# EAGLE design cam_new (EAGLE 9.6.2)
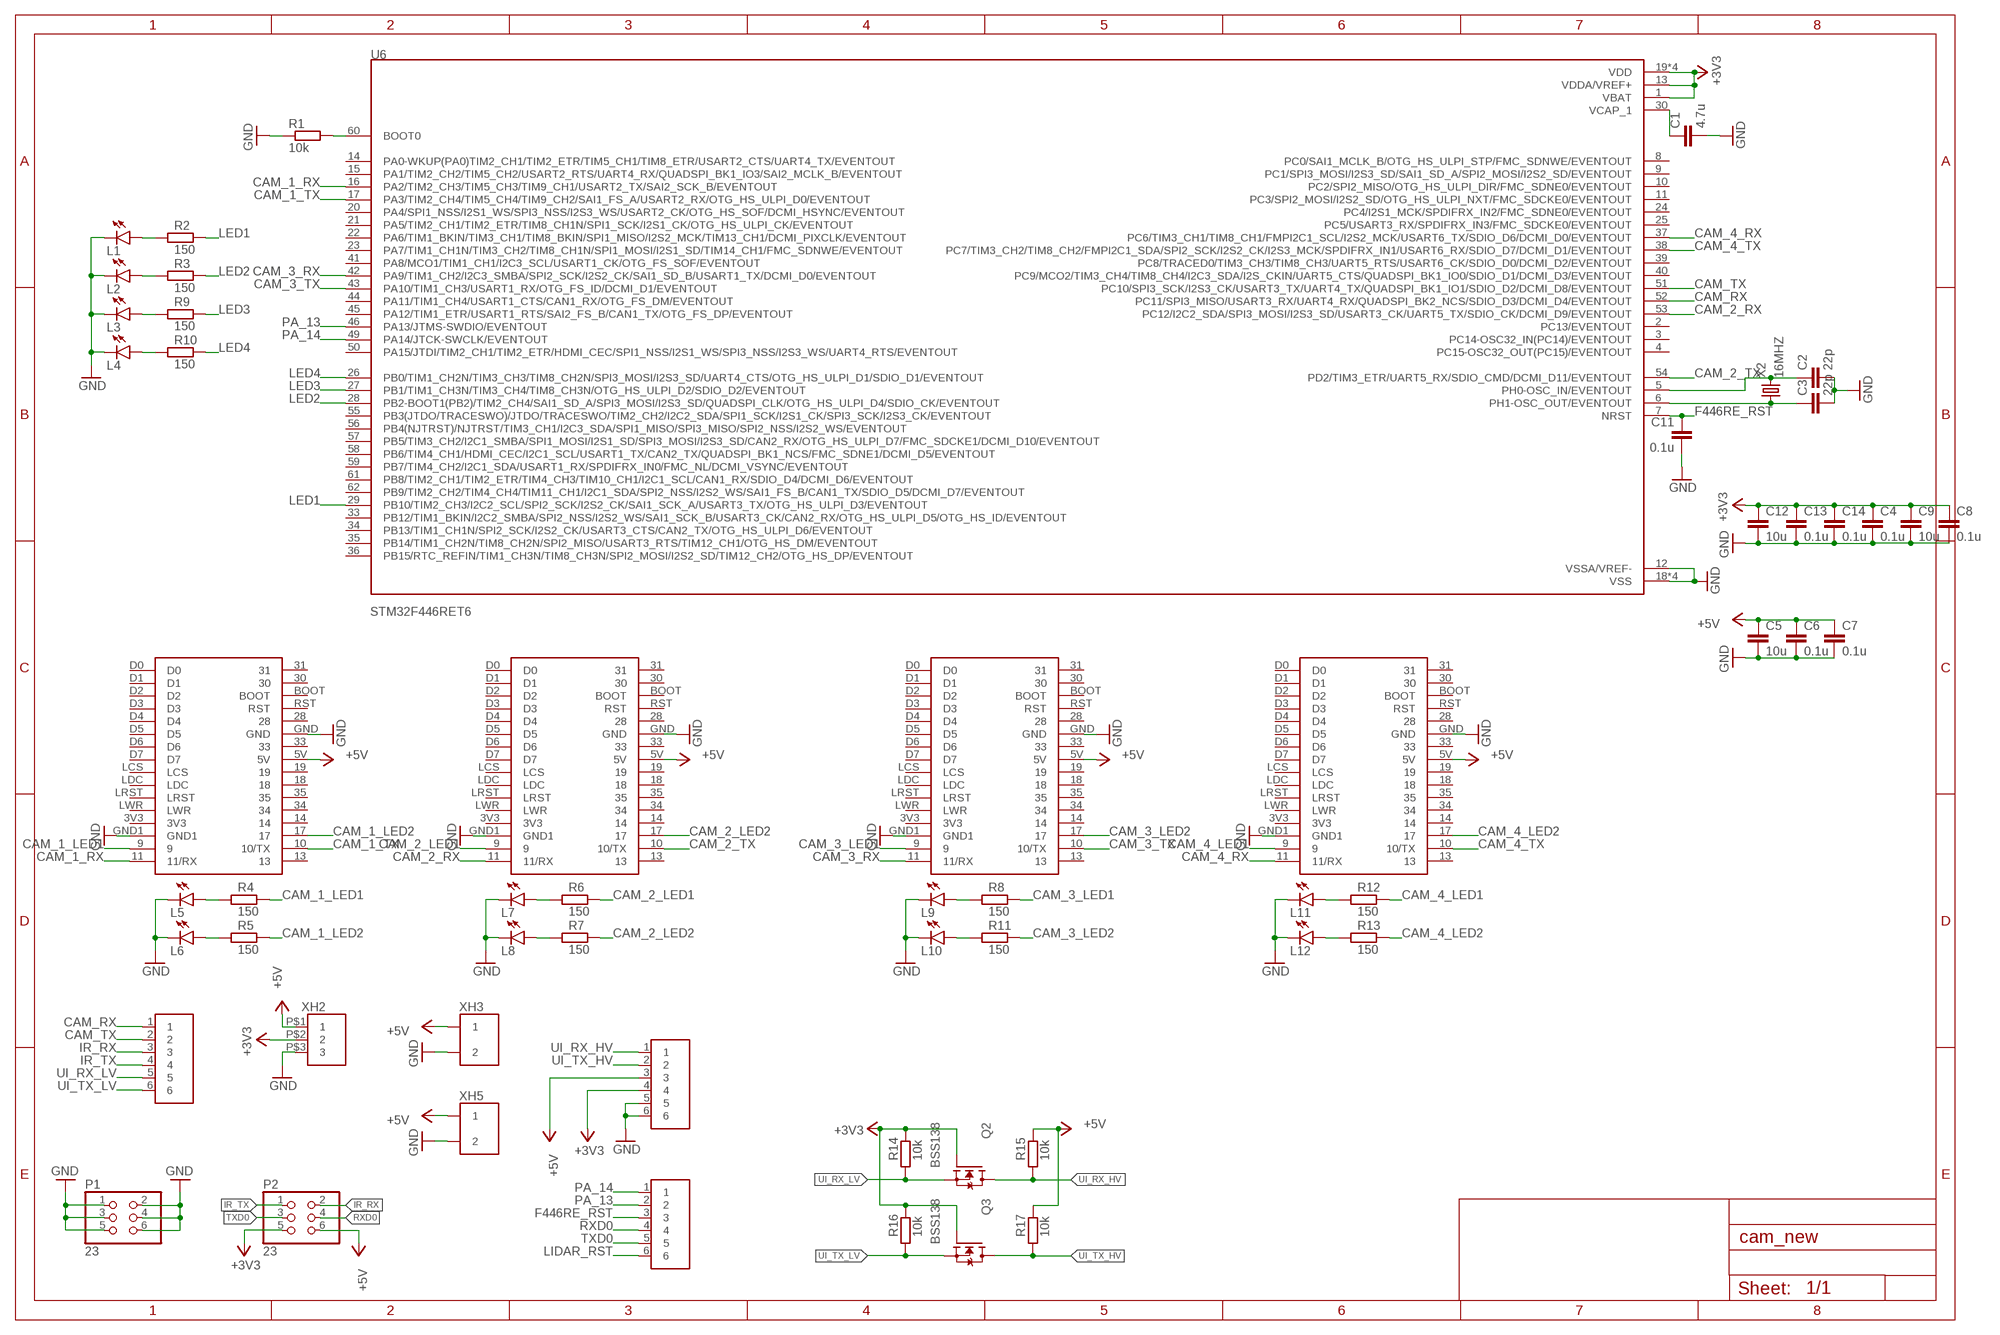
[diagram p0: schematic, sheet 1]

## Parts
C1  4.7u  C-EUC0603  [C0603]
C2  22p  C-EUC0603  [C0603]
C3  22p  C-EUC0603  [C0603]
C4  0.1u  C-EUC0603  [C0603]
C5  10u  C-EUC0805  [C0805]
C6  0.1u  C-EUC0603  [C0603]
C7  0.1u  C-EUC0603  [C0603]
C8  0.1u  C-EUC0603  [C0603]
C9  10u  C-EUC0805  [C0805]
C11  0.1u  C-EUC0603  [C0603]
C12  10u  C-EUC0805  [C0805]
C13  0.1u  C-EUC0603  [C0603]
C14  0.1u  C-EUC0603  [C0603]
L1  SML-E12P8WT86  [LED_SML-LXFM0603SIC-TR]
L2  SML-E12P8WT86  [LED_SML-LXFM0603SIC-TR]
L3  SML-E12P8WT86  [LED_SML-LXFM0603SIC-TR]
L4  SML-E12P8WT86  [LED_SML-LXFM0603SIC-TR]
L5  SML-E12P8WT86  [LED_SML-LXFM0603SIC-TR]
L6  SML-E12P8WT86  [LED_SML-LXFM0603SIC-TR]
L7  SML-E12P8WT86  [LED_SML-LXFM0603SIC-TR]
L8  SML-E12P8WT86  [LED_SML-LXFM0603SIC-TR]
L9  SML-E12P8WT86  [LED_SML-LXFM0603SIC-TR]
L10  SML-E12P8WT86  [LED_SML-LXFM0603SIC-TR]
L11  SML-E12P8WT86  [LED_SML-LXFM0603SIC-TR]
L12  SML-E12P8WT86  [LED_SML-LXFM0603SIC-TR]
P1  23  [2*3]
P2  23  [2*3]
Q2  BSS138  [SOT95P240X111-3N]
Q3  BSS138  [SOT95P240X111-3N]
R1  10k  R-EU_R0603  [R0603]
R2  150  R-EU_R0603  [R0603]
R3  150  R-EU_R0603  [R0603]
R4  150  R-EU_R0603  [R0603]
R5  150  R-EU_R0603  [R0603]
R6  150  R-EU_R0603  [R0603]
R7  150  R-EU_R0603  [R0603]
R8  150  R-EU_R0603  [R0603]
R9  150  R-EU_R0603  [R0603]
R10  150  R-EU_R0603  [R0603]
R11  150  R-EU_R0603  [R0603]
R12  150  R-EU_R0603  [R0603]
R13  150  R-EU_R0603  [R0603]
R14  10k  R-EU_R0603  [R0603]
R15  10k  R-EU_R0603  [R0603]
R16  10k  R-EU_R0603  [R0603]
R17  10k  R-EU_R0603  [R0603]
U1  M1N  [M1N]
U2  M1N  [M1N]
U3  M1N  [M1N]
U4  M1N  [M1N]
U6  STM32F446RET6  [QFP50P1200X1200X160-64N]
X2  16MHZ  [16MHZ]
XH1  6B  [6B]
XH2  3B  [3B]
XH3  2B  [2B]
XH4  6B  [6B]
XH5  2B  [2B]
XH6  6B  [6B]

## Nets
+3V3: C4.1 C8.1 C9.1 C12.1 C13.1 C14.1 P2.5 Q2.1(G) Q3.1(G) R14.2 R16.2 U6.1(VBAT) U6.13(VDDA/VREF+) U6.19(VDD) U6.32(VDD) U6.48(VDD) U6.64(VDD) XH2.P$2 XH4.4
+5V: C5.1 C6.1 C7.1 P2.6 R15.2 R17.2 U1.5V U2.5V U3.5V U4.5V XH2.P$1 XH3.P$1 XH4.3 XH5.P$1
CAM_1_LED1: R4.2 U1.9
CAM_1_LED2: R5.2 U1.17
CAM_1_RX: U1.11(11/RX) U6.16(PA2/TIM2_CH3/TIM5_CH3/TIM9_CH1/USART2_TX/SAI2_SCK_B/EVENTOUT)
CAM_1_TX: U1.10(10/TX) U6.17(PA3/TIM2_CH4/TIM5_CH4/TIM9_CH2/SAI1_FS_A/USART2_RX/OTG_HS_ULPI_D0/EVENTOUT)
CAM_2_LED1: R6.2 U2.9
CAM_2_LED2: R7.2 U2.17
CAM_2_RX: U2.11(11/RX) U6.53(PC12/I2C2_SDA/SPI3_MOSI/I2S3_SD/USART3_CK/UART5_TX/SDIO_CK/DCMI_D9/EVENTOUT)
CAM_2_TX: U2.10(10/TX) U6.54(PD2/TIM3_ETR/UART5_RX/SDIO_CMD/DCMI_D11/EVENTOUT)
CAM_3_LED1: R8.2 U3.9
CAM_3_LED2: R11.2 U3.17
CAM_3_RX: U3.11(11/RX) U6.42(PA9/TIM1_CH2/I2C3_SMBA/SPI2_SCK/I2S2_CK/SAI1_SD_B/USART1_TX/DCMI_D0/EVENTOUT)
CAM_3_TX: U3.10(10/TX) U6.43(PA10/TIM1_CH3/USART1_RX/OTG_FS_ID/DCMI_D1/EVENTOUT)
CAM_4_LED1: R12.2 U4.9
CAM_4_LED2: R13.2 U4.17
CAM_4_RX: U4.11(11/RX) U6.37(PC6/TIM3_CH1/TIM8_CH1/FMPI2C1_SCL/I2S2_MCK/USART6_TX/SDIO_D6/DCMI_D0/EVENTOUT)
CAM_4_TX: U4.10(10/TX) U6.38(PC7/TIM3_CH2/TIM8_CH2/FMPI2C1_SDA/SPI2_SCK/I2S2_CK/I2S3_MCK/SPDIFRX_IN1/USART6_RX/SDIO_D7/DCMI_D1/EVENTOUT)
CAM_RX: U6.52(PC11/SPI3_MISO/USART3_RX/UART4_RX/QUADSPI_BK2_NCS/SDIO_D3/DCMI_D4/EVENTOUT) XH1.1
CAM_TX: U6.51(PC10/SPI3_SCK/I2S3_CK/USART3_TX/UART4_TX/QUADSPI_BK1_IO1/SDIO_D2/DCMI_D8/EVENTOUT) XH1.2
F446RE_RST: C11.1 U6.7(NRST) XH6.3
GND: C1.2 C2.2 C3.2 C4.2 C5.2 C6.2 C7.2 C8.2 C9.2 C11.2 C12.2 C13.2 C14.2 L1.C L2.C L3.C L4.C L5.C L6.C L7.C L8.C L9.C L10.C L11.C L12.C P1.1 P1.2 P1.3 P1.4 P1.5 P1.6 R1.1 U1.GND U1.GND1 U2.GND U2.GND1 U3.GND U3.GND1 U4.GND U4.GND1 U6.12(VSSA/VREF-) U6.18(VSS) U6.31(VSS) U6.47(VSS) U6.63(VSS) XH2.P$3 XH3.P$2 XH4.5 XH4.6 XH5.P$2
IR_RX: P2.2 XH1.3
IR_TX: P2.1 XH1.4
LED1: R2.2 U6.29(PB10/TIM2_CH3/I2C2_SCL/SPI2_SCK/I2S2_CK/SAI1_SCK_A/USART3_TX/OTG_HS_ULPI_D3/EVENTOUT)
LED2: R3.2 U6.28(PB2-BOOT1(PB2)/TIM2_CH4/SAI1_SD_A/SPI3_MOSI/I2S3_SD/QUADSPI_CLK/OTG_HS_ULPI_D4/SDIO_CK/EVENTOUT)
LED3: R9.2 U6.27(PB1/TIM1_CH3N/TIM3_CH4/TIM8_CH3N/OTG_HS_ULPI_D2/SDIO_D2/EVENTOUT)
LED4: R10.2 U6.26(PB0/TIM1_CH2N/TIM3_CH3/TIM8_CH2N/SPI3_MOSI/I2S3_SD/UART4_CTS/OTG_HS_ULPI_D1/SDIO_D1/EVENTOUT)
LIDAR_RST: XH6.6
N$1: C1.1 U6.30(VCAP_1)
N$2: R1.2 U6.60(BOOT0)
N$3: C2.1 U6.5(PH0-OSC_IN/EVENTOUT) X2.P$2
N$4: C3.1 U6.6(PH1-OSC_OUT/EVENTOUT) X2.P$1
N$5: L2.A R3.1
N$6: L4.A R10.1
N$7: L1.A R2.1
N$8: L6.A R5.1
N$9: L3.A R9.1
N$10: L5.A R4.1
N$11: L8.A R7.1
N$12: L7.A R6.1
N$13: L10.A R11.1
N$14: L9.A R8.1
N$15: L12.A R13.1
N$16: L11.A R12.1
PA_13: U6.46(PA13/JTMS-SWDIO/EVENTOUT) XH6.2
PA_14: U6.49(PA14/JTCK-SWCLK/EVENTOUT) XH6.1
RXD0: P2.4 XH6.4
TXD0: P2.3 XH6.5
UI_RX_HV: Q2.3(D) R15.1 XH4.1
UI_RX_LV: Q2.2(S) R14.1 XH1.5
UI_TX_HV: Q3.3(D) R17.1 XH4.2
UI_TX_LV: Q3.2(S) R16.1 XH1.6
Unconnected: U1.3V3 U1.13 U1.14 U1.18 U1.19 U1.28 U1.30 U1.31 U1.33 U1.34 U1.35 U1.BOOT U1.D0 U1.D1 U1.D2 U1.D3 U1.D4 U1.D5 U1.D6 U1.D7 U1.LCS U1.LDC U1.LRST U1.LWR U1.RST U2.3V3 U2.13 U2.14 U2.18 U2.19 U2.28 U2.30 U2.31 U2.33 U2.34 U2.35 U2.BOOT U2.D0 U2.D1 U2.D2 U2.D3 U2.D4 U2.D5 U2.D6 U2.D7 U2.LCS U2.LDC U2.LRST U2.LWR U2.RST U3.3V3 U3.13 U3.14 U3.18 U3.19 U3.28 U3.30 U3.31 U3.33 U3.34 U3.35 U3.BOOT U3.D0 U3.D1 U3.D2 U3.D3 U3.D4 U3.D5 U3.D6 U3.D7 U3.LCS U3.LDC U3.LRST U3.LWR U3.RST U4.3V3 U4.13 U4.14 U4.18 U4.19 U4.28 U4.30 U4.31 U4.33 U4.34 U4.35 U4.BOOT U4.D0 U4.D1 U4.D2 U4.D3 U4.D4 U4.D5 U4.D6 U4.D7 U4.LCS U4.LDC U4.LRST U4.LWR U4.RST U6.2(PC13/EVENTOUT) U6.3(PC14-OSC32_IN(PC14)/EVENTOUT) U6.4(PC15-OSC32_OUT(PC15)/EVENTOUT) U6.8(PC0/SAI1_MCLK_B/OTG_HS_ULPI_STP/FMC_SDNWE/EVENTOUT) U6.9(PC1/SPI3_MOSI/I2S3_SD/SAI1_SD_A/SPI2_MOSI/I2S2_SD/EVENTOUT) U6.10(PC2/SPI2_MISO/OTG_HS_ULPI_DIR/FMC_SDNE0/EVENTOUT) U6.11(PC3/SPI2_MOSI/I2S2_SD/OTG_HS_ULPI_NXT/FMC_SDCKE0/EVENTOUT) U6.14(PA0-WKUP(PA0)TIM2_CH1/TIM2_ETR/TIM5_CH1/TIM8_ETR/USART2_CTS/UART4_TX/EVENTOUT) U6.15(PA1/TIM2_CH2/TIM5_CH2/USART2_RTS/UART4_RX/QUADSPI_BK1_IO3/SAI2_MCLK_B/EVENTOUT) U6.20(PA4/SPI1_NSS/I2S1_WS/SPI3_NSS/I2S3_WS/USART2_CK/OTG_HS_SOF/DCMI_HSYNC/EVENTOUT) U6.21(PA5/TIM2_CH1/TIM2_ETR/TIM8_CH1N/SPI1_SCK/I2S1_CK/OTG_HS_ULPI_CK/EVENTOUT) U6.22(PA6/TIM1_BKIN/TIM3_CH1/TIM8_BKIN/SPI1_MISO/I2S2_MCK/TIM13_CH1/DCMI_PIXCLK/EVENTOUT) U6.23(PA7/TIM1_CH1N/TIM3_CH2/TIM8_CH1N/SPI1_MOSI/I2S1_SD/TIM14_CH1/FMC_SDNWE/EVENTOUT) U6.24(PC4/I2S1_MCK/SPDIFRX_IN2/FMC_SDNE0/EVENTOUT) U6.25(PC5/USART3_RX/SPDIFRX_IN3/FMC_SDCKE0/EVENTOUT) U6.33(PB12/TIM1_BKIN/I2C2_SMBA/SPI2_NSS/I2S2_WS/SAI1_SCK_B/USART3_CK/CAN2_RX/OTG_HS_ULPI_D5/OTG_HS_ID/EVENTOUT) U6.34(PB13/TIM1_CH1N/SPI2_SCK/I2S2_CK/USART3_CTS/CAN2_TX/OTG_HS_ULPI_D6/EVENTOUT) U6.35(PB14/TIM1_CH2N/TIM8_CH2N/SPI2_MISO/USART3_RTS/TIM12_CH1/OTG_HS_DM/EVENTOUT) U6.36(PB15/RTC_REFIN/TIM1_CH3N/TIM8_CH3N/SPI2_MOSI/I2S2_SD/TIM12_CH2/OTG_HS_DP/EVENTOUT) U6.39(PC8/TRACED0/TIM3_CH3/TIM8_CH3/UART5_RTS/USART6_CK/SDIO_D0/DCMI_D2/EVENTOUT) U6.40(PC9/MCO2/TIM3_CH4/TIM8_CH4/I2C3_SDA/I2S_CKIN/UART5_CTS/QUADSPI_BK1_IO0/SDIO_D1/DCMI_D3/EVENTOUT) U6.41(PA8/MCO1/TIM1_CH1/I2C3_SCL/USART1_CK/OTG_FS_SOF/EVENTOUT) U6.44(PA11/TIM1_CH4/USART1_CTS/CAN1_RX/OTG_FS_DM/EVENTOUT) U6.45(PA12/TIM1_ETR/USART1_RTS/SAI2_FS_B/CAN1_TX/OTG_FS_DP/EVENTOUT) U6.50(PA15/JTDI/TIM2_CH1/TIM2_ETR/HDMI_CEC/SPI1_NSS/I2S1_WS/SPI3_NSS/I2S3_WS/UART4_RTS/EVENTOUT) U6.55(PB3(JTDO/TRACESWO)/JTDO/TRACESWO/TIM2_CH2/I2C2_SDA/SPI1_SCK/I2S1_CK/SPI3_SCK/I2S3_CK/EVENTOUT) U6.56(PB4(NJTRST)/NJTRST/TIM3_CH1/I2C3_SDA/SPI1_MISO/SPI3_MISO/SPI2_NSS/I2S2_WS/EVENTOUT) U6.57(PB5/TIM3_CH2/I2C1_SMBA/SPI1_MOSI/I2S1_SD/SPI3_MOSI/I2S3_SD/CAN2_RX/OTG_HS_ULPI_D7/FMC_SDCKE1/DCMI_D10/EVENTOUT) U6.58(PB6/TIM4_CH1/HDMI_CEC/I2C1_SCL/USART1_TX/CAN2_TX/QUADSPI_BK1_NCS/FMC_SDNE1/DCMI_D5/EVENTOUT) U6.59(PB7/TIM4_CH2/I2C1_SDA/USART1_RX/SPDIFRX_IN0/FMC_NL/DCMI_VSYNC/EVENTOUT) U6.61(PB8/TIM2_CH1/TIM2_ETR/TIM4_CH3/TIM10_CH1/I2C1_SCL/CAN1_RX/SDIO_D4/DCMI_D6/EVENTOUT) U6.62(PB9/TIM2_CH2/TIM4_CH4/TIM11_CH1/I2C1_SDA/SPI2_NSS/I2S2_WS/SAI1_FS_B/CAN1_TX/SDIO_D5/DCMI_D7/EVENTOUT)

## Library data of the parts
C1-C9 C11-C14 = rcl:C-EU: CAPACITOR, European symbol; SPICEPREFIX: C
L1-L12 = LED:SML-E12P8WT86
P1 P2 = pin_socket:2*3
Q2 Q3 = BSS138:BSS138: N-Channel 50V 220mA (Ta) 360mW (Ta) Surface Mount SOT-23-3 Check availability <https://pricing.snapeda.com/parts/BSS138/onsemi/view-part?ref=eda>; AVAILABILITY: In Stock; CHECK_PRICES: https://www.snapeda.com/parts/BSS138/Onsemi/view-part/?ref=eda; DESCRIPTION: N-Channel 50 V 220mA (Ta) 350mW (Ta) Surface Mount SOT-23-3; MF: onsemi; MP: BSS138; PACKAGE: SOT-23-3 ON Semiconductor; PRICE: None; PURCHASE-URL: https://www.snapeda.com/api/url_track_click_mouser/?unipart_id=7326959&manufacturer=onsemi&part_name=BSS138&search_term=bss138; SNAPEDA_LINK: https://www.snapeda.com/parts/BSS138/Onsemi/view-part/?ref=snap
R1-R17 = rcl:R-EU_: RESISTOR, European symbol; SPICEPREFIX: R
U1-U4 = sipeed:M1N
U6 = STM32F446RET6:STM32F446RET6: MCU 32-Bit STM32 ARM Cortex M4 RISC 512KB Flash 2.5V/3.3V 64-Pin LQFP Tray Check availability <https://pricing.snapeda.com/parts/STM32F446RET6/STMicroelectronics/view-part?ref=eda>; AVAILABILITY: In Stock; DESCRIPTION: ARM® Cortex®-M4 STM32F4 Microcontroller IC 32-Bit Single-Core 180MHz 512KB (512K x 8) FLASH 64-LQFP (10x10); MF: STMicroelectronics; MP: STM32F446RET6; PACKAGE: LQFP-64 STMicroelectronics; PRICE: None; PURCHASE-URL: https://pricing.snapeda.com/search/part/STM32F446RET6/?ref=eda
X2 = crystal:16MHZ
XH1 XH4 XH6 = XH:6B
XH2 = XH:3B
XH3 XH5 = XH:2B

## Board
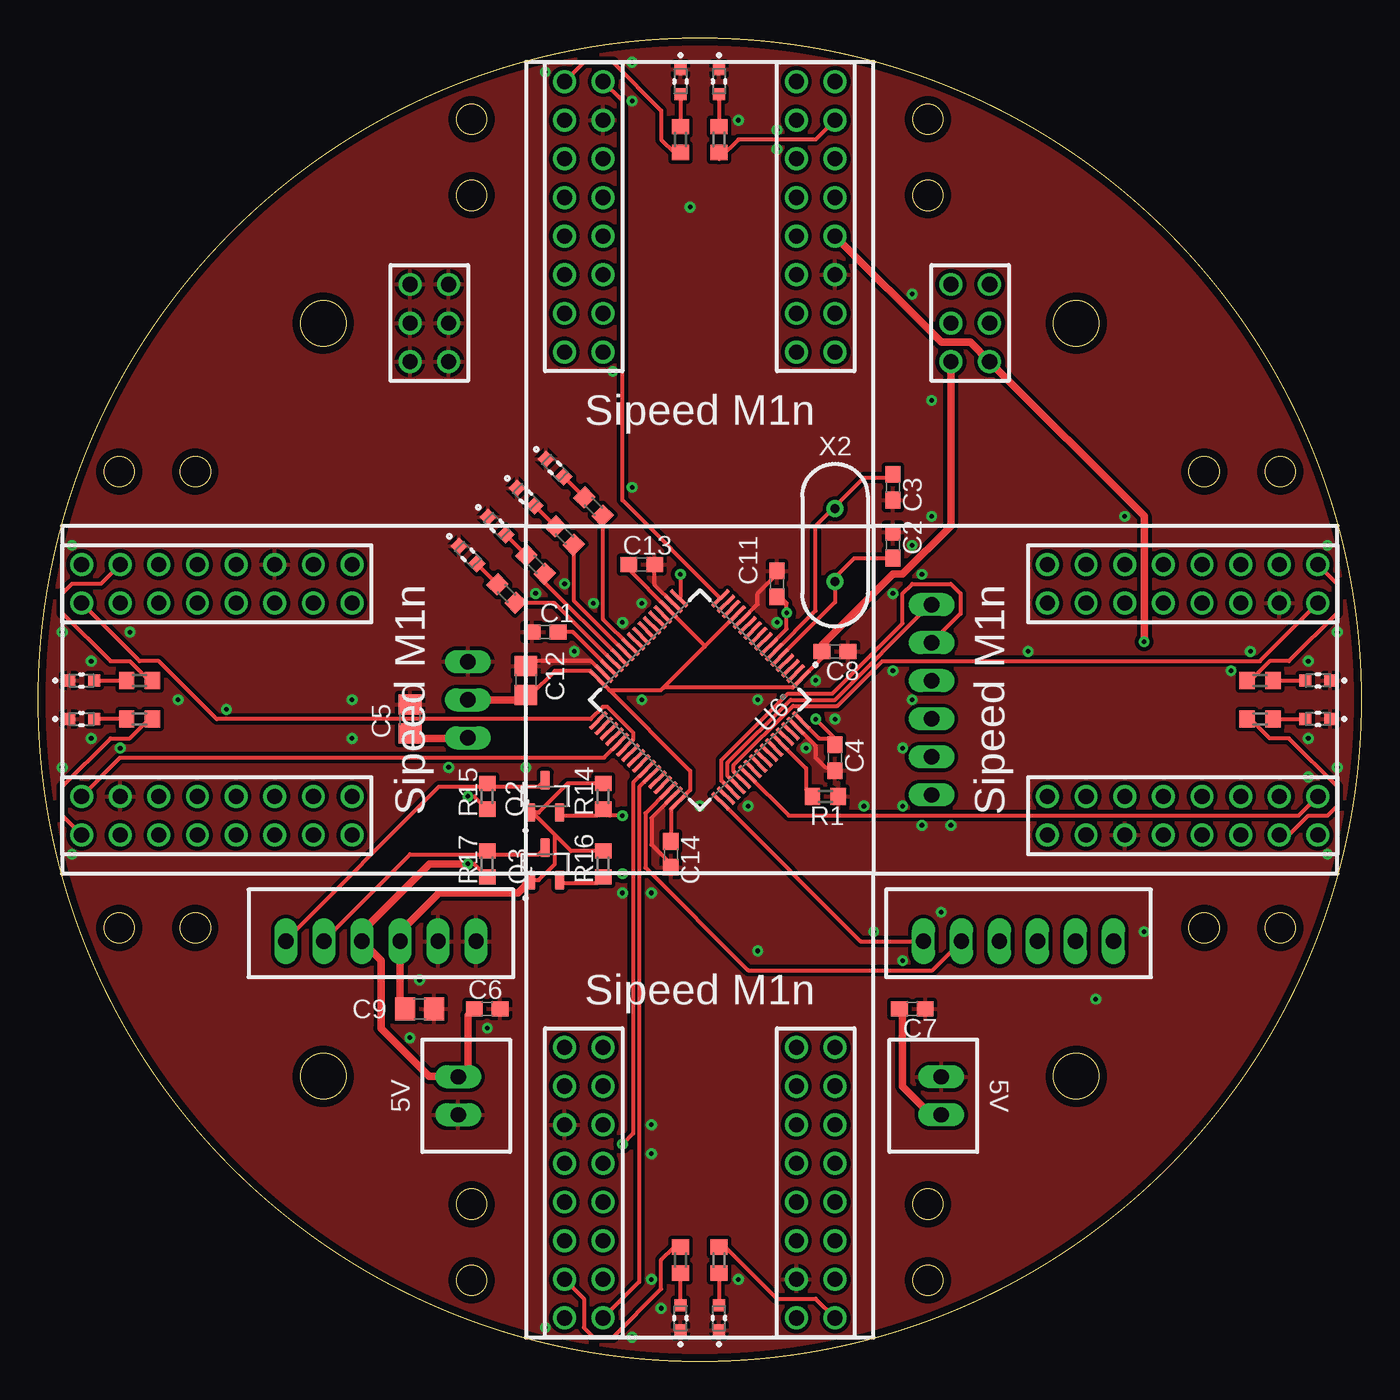
[diagram p1: board, top side]
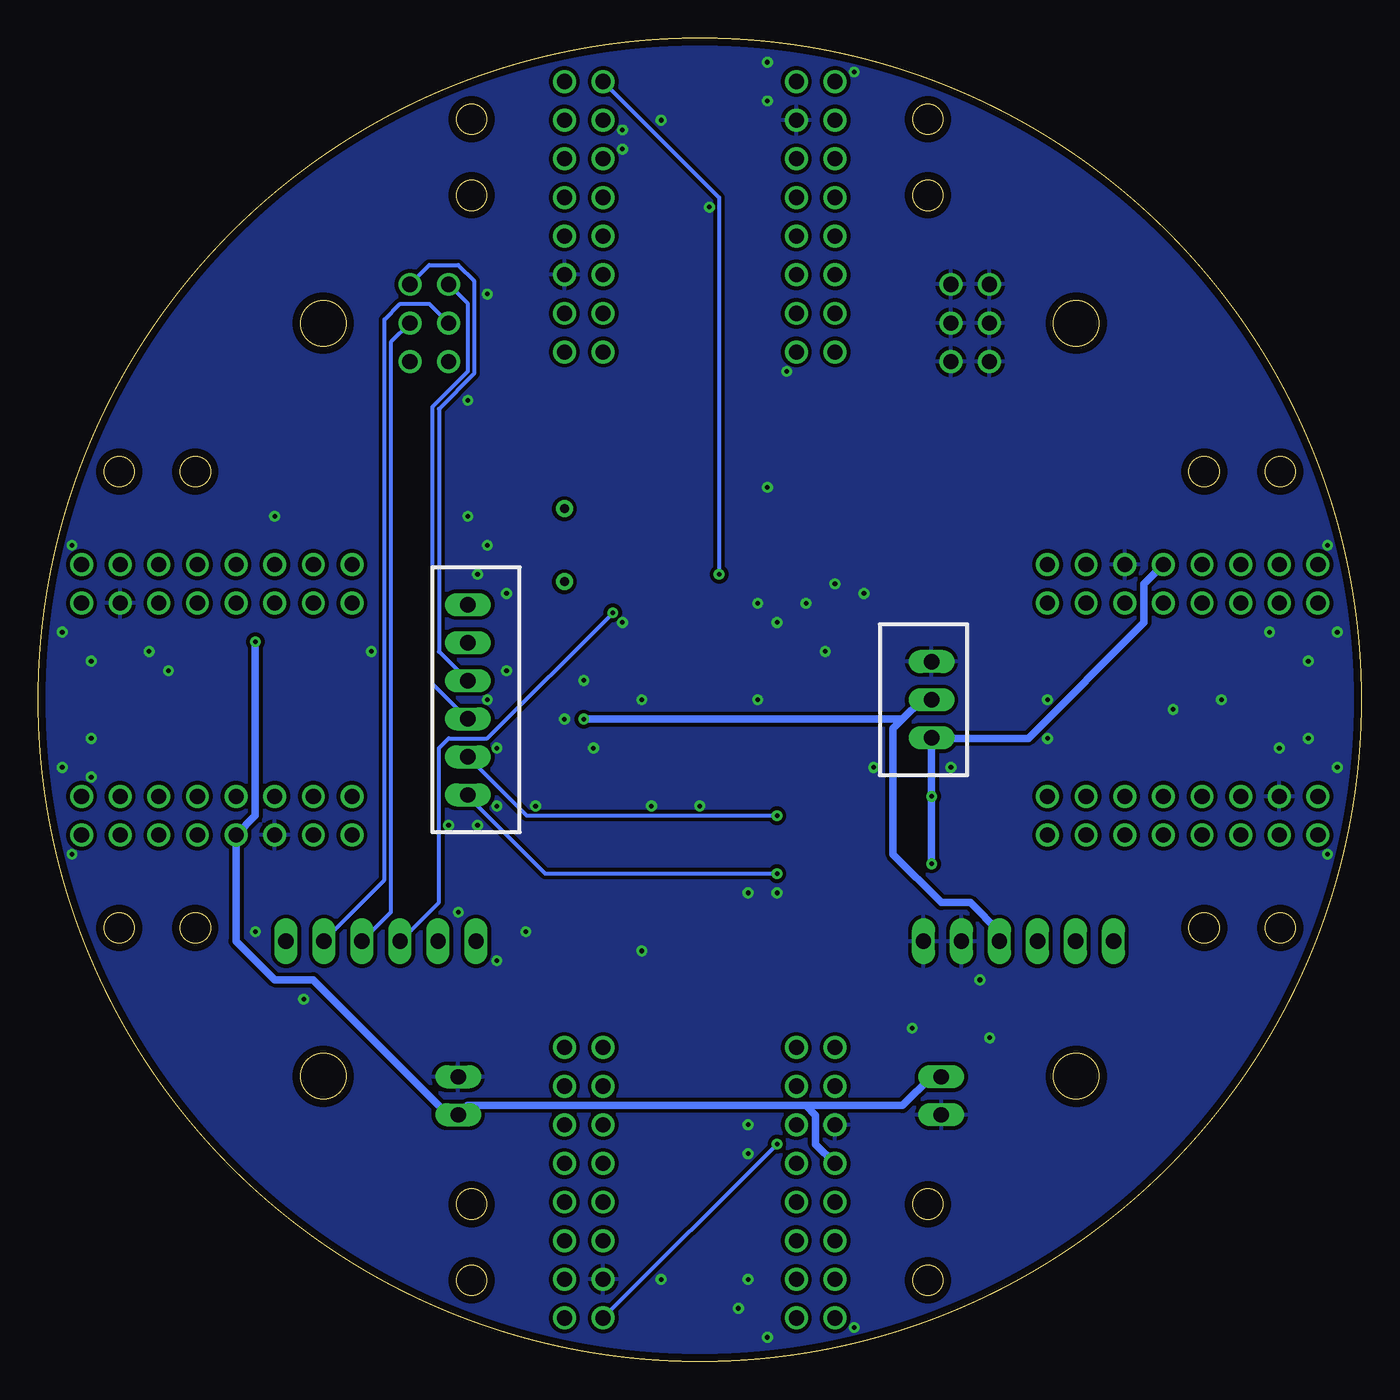
[diagram p2: board, bottom side, seen from below]

Size 87 x 87 mm. Coordinates in mm from the lower left corner, seen from the top.
Outline: circle at 76.66,28.5 radius 1
Outline: circle at 10.34,58.5 radius 1
Outline: circle at 58.5,10.34 radius 1
Outline: circle at 76.66,58.5 radius 1
Outline: circle at 10.34,28.5 radius 1
Outline: circle at 28.5,10.34 radius 1
Outline: circle at 28.5,76.66 radius 1
Outline: circle at 58.5,76.66 radius 1
Outline: circle at 28.5,5.34 radius 1
Outline: circle at 58.5,81.66 radius 1
Outline: circle at 28.5,81.66 radius 1
Outline: circle at 58.5,5.34 radius 1
Outline: circle at 5.34,28.5 radius 1
Outline: circle at 81.66,58.5 radius 1
Outline: circle at 5.34,58.5 radius 1
Outline: circle at 81.66,28.5 radius 1
Outline: circle at 43.5,43.5 radius 43.5
Outline: circle at 18.75,68.25 radius 1.5
Outline: circle at 18.75,18.75 radius 1.5
Outline: circle at 68.25,68.25 radius 1.5
Copper layers (1*16): Top 0.035mm / dielectric 1.5mm / Bottom 0.035mm
Design rules "default *": minimum track width 6mil, minimum drill 0.3mm, track to track 6mil, track to pad 6mil, pad to pad 6mil, via to via 6mil, smd to smd 6mil, copper to edge 20mil, drill to drill 6mil, minimum pad ring 10mil, minimum via ring 8mil, stop-mask expansion 4mil, vias tented up to drill 0mil, thermal gap 10mil

### Footprints (pad centres in the part's own frame; a part is rotated, then mirrored left to right if it is on the bottom)
C0603 = smd 1.1 x 1: 1 -0.85,0; 2 0.85,0
C0805 = smd 1.3 x 1.5: 1 -0.95,0; 2 0.95,0
LED_SML-LXFM0603SIC-TR = smd 0.8 x 0.8: A 0.825,0; C -0.825,0
2*3 = drill 1: 1 -1.27,2.54; 2 1.27,2.54; 3 -1.27,0; 4 1.27,0; 5 -1.27,-2.54; 6 1.27,-2.54
SOT95P240X111-3N = smd 1.23 x 0.6: 1 -1.06,0.95; 2 -1.06,-0.95; 3 1.06,0
R0603 = smd 1 x 1.1: 1 -0.85,0; 2 0.85,0
M1N = drill 1: 3V3 8.89,2.54; 5V -8.89,10.16; 9 8.89,0; 10 -6.35,0; 11 6.35,0; 13 -8.89,0; 14 -6.35,2.54; 17 -8.89,2.54; 18 -8.89,7.62; 19 -6.35,7.62; 28 -6.35,12.7; 30 -8.89,17.78; 31 -6.35,17.78; 33 -6.35,10.16; 34 -8.89,5.08; 35 -6.35,5.08; BOOT -6.35,15.24; D0 8.89,17.78; D1 6.35,17.78; D2 8.89,15.24; D3 6.35,15.24; D4 8.89,12.7; D5 6.35,12.7; D6 8.89,10.16; D7 6.35,10.16; GND -8.89,12.7; GND1 6.35,2.54; LCS 8.89,7.62; LDC 6.35,7.62; LRST 8.89,5.08; LWR 6.35,5.08; RST -8.89,15.24
QFP50P1200X1200X160-64N = smd 1.56 x 0.28: 1 -5.68,3.75; 2 -5.68,3.25; 3 -5.68,2.75; 4 -5.68,2.25; 5 -5.68,1.75; 6 -5.68,1.25; 7 -5.68,0.75; 8 -5.68,0.25; 9 -5.68,-0.25; 10 -5.68,-0.75; 11 -5.68,-1.25; 12 -5.68,-1.75; 13 -5.68,-2.25; 14 -5.68,-2.75; 15 -5.68,-3.25; 16 -5.68,-3.75; 33 5.68,-3.75; 34 5.68,-3.25; 35 5.68,-2.75; 36 5.68,-2.25; 37 5.68,-1.75; 38 5.68,-1.25; 39 5.68,-0.75; 40 5.68,-0.25; 41 5.68,0.25; 42 5.68,0.75; 43 5.68,1.25; 44 5.68,1.75; 45 5.68,2.25; 46 5.68,2.75; 47 5.68,3.25; 48 5.68,3.75 | smd 0.28 x 1.56: 17 -3.75,-5.68; 18 -3.25,-5.68; 19 -2.75,-5.68; 20 -2.25,-5.68; 21 -1.75,-5.68; 22 -1.25,-5.68; 23 -0.75,-5.68; 24 -0.25,-5.68; 25 0.25,-5.68; 26 0.75,-5.68; 27 1.25,-5.68; 28 1.75,-5.68; 29 2.25,-5.68; 30 2.75,-5.68; 31 3.25,-5.68; 32 3.75,-5.68; 49 3.75,5.68; 50 3.25,5.68; 51 2.75,5.68; 52 2.25,5.68; 53 1.75,5.68; 54 1.25,5.68; 55 0.75,5.68; 56 0.25,5.68; 57 -0.25,5.68; 58 -0.75,5.68; 59 -1.25,5.68; 60 -1.75,5.68; 61 -2.25,5.68; 62 -2.75,5.68; 63 -3.25,5.68; 64 -3.75,5.68
16MHZ = drill 0.6: P$1 -2.4,0; P$2 2.4,0
6B = drill 1 long: 1 0,6.25; 2 0,3.75; 3 0,1.25; 4 0,-1.25; 5 0,-3.75; 6 0,-6.25
3B = drill 1 long: P$1 0,2.5; P$2 0,0; P$3 0,-2.5
2B = drill 1 long: P$1 0,1.25; P$2 0,-1.25

### Placement (x,y rotation side)
C1  33.34,47.94 180 top
C2  56.2,53.66 90 top
C3  56.2,57.47 270 top
C4  52.39,39.69 270 top
C5  24.45,42.23 90 top
C6  29.53,23.18 0 top
C7  57.47,23.18 0 top
C8  52.39,46.67 0 top
C9  25.09,23.18 0 top
C11  48.58,51.12 90 top
C12  32.07,44.77 90 top
C13  39.69,52.39 0 top
C14  41.6,33.34 270 top
L1  28.26,53.02 315 top
L2  30.17,54.93 315 top
L3  32.07,56.83 315 top
L4  33.98,58.74 315 top
L5  42.23,84.14 270 top
L6  44.77,84.14 270 top
L7  84.14,44.77 180 top
L8  84.14,42.23 180 top
L9  44.77,2.86 90 top
L10  42.23,2.86 90 top
L11  2.86,42.23 0 top
L12  2.86,44.77 0 top
P1  25.72,68.26 0 top
P2  61.28,68.26 0 top
Q2  33.34,37.15 90 top
Q3  33.34,32.7 90 top
R1  51.76,37.15 180 top
R2  30.8,50.48 315 top
R3  32.71,52.39 315 top
R4  42.23,80.33 270 top
R5  44.77,80.33 270 top
R6  80.33,44.77 180 top
R7  80.33,42.23 180 top
R8  44.77,6.67 90 top
R9  34.61,54.29 315 top
R10  36.52,56.2 315 top
R11  42.23,6.67 90 top
R12  6.67,42.23 0 top
R13  6.67,44.77 0 top
R14  37.15,37.15 90 top
R15  29.53,37.15 270 top
R16  37.15,32.7 90 top
R17  29.53,32.7 270 top
U1  43.5,84.14 180 top
U2  84.14,43.5 90 top
U3  43.5,2.86 0 top
U4  2.86,43.5 270 top
U6  43.5,43.5 225 top
X2  52.39,53.66 270 top
XH1  58.74,43.5 0 bottom
XH2  28.26,43.5 180 bottom
XH3  27.63,17.46 0 top
XH4  22.55,27.62 90 top
XH5  59.38,17.46 180 top
XH6  64.46,27.62 90 top

### Tracks (layer width: path | path; a pad name or v marks a point on that pad's centre or on a via)
+3V3  (via drill 0.3)
  Top 0.25: C13.1 38.84,52.05 U6.19 43.81,47.07 43.81,47 | 51.34,40.96 51.97,40.96 C4.1 52.39,40.96 v51.12,42.23 | C12.1 32.39,43.82 33.98,45.4 36.29,45.4 U6.32 37.56,44.13 | C8.1 51.54,46.24 U6.1 49.61,44.3 41.12,44.3 | Q3.1 32.92,31.64 33.98,32.7 33.98,34.61 | 33.98,34.61 32.5,36.09 Q2.1 32.92,36.09 34.83,38 R14.2 | R16.2 35.03,33.55 33.98,34.61 | 41.12,44.3 43.81,47 | 43.81,47 U6.13 | 37.56,44.13 40.95,44.13 41.12,44.3 | 37.56,44.13 42.87,38.83 42.87,37.56 U6.48 | U6.48 | U6.48 41.6,36.29 C14.1 | U6.64 51.34,40.96 | 51.34,40.96
  Top 0.5: C8.1 51.54,47.09 56.2,51.75 56.84,51.75 60.01,54.93 P2.5 | C12.1 31.75,43.5 XH2.P$2 | C9.1 23.82,23.5 23.82,27.6 XH4.4 23.8,28.24 26.36,30.8 31.55,30.8 Q3.1
  Bottom 0.5: v51.12,42.23 30.17,42.23 | 30.17,42.23 28.9,43.5 XH2.P$2 | XH4.4 23.8,28.24 25.72,30.16 27.63,30.16 30.8,33.34 30.8,41.59 30.17,42.23
+5V  (via drill 0.3)
  Top 0.25: v28.26,37.15 28.68,37.15 R15.2 | v28.26,32.71 28.68,32.71 R17.2
  Top 0.5: v72.71,47.31 72.71,55.56 P2.6 61.28,66.99 59.38,66.99 U1.5V | C5.1 24.77,40.96 28.22,40.96 XH2.P$1 | C6.1 28.26,22.76 28.26,19.35 XH3.P$1 27.61,18.73 25.72,18.73 22.55,21.91 22.55,26.37 XH4.3 21.3,28.28 25.72,32.71 v28.26,32.71 | C7.1 56.84,22.96 56.84,18.1 58.74,16.19 59.36,16.19 XH5.P$1
  Bottom 0.25: XH2.P$1 28.26,40.96
  Bottom 0.5: v72.71,47.31 72.71,35.88 U2.5V 73.98,27.62 71.44,25.08 68.9,25.08 60.01,16.19 59.4,16.19 XH5.P$1 58.76,16.83 36.52,16.83 | U4.5V 14.29,51.12 14.29,48.58 21.91,40.96 28.26,40.96 | U3.5V 35.88,14.29 35.88,16.19 36.52,16.83 | XH3.P$1 28.28,18.71 30.17,16.83 36.52,16.83 | XH2.P$1 v28.26,37.15 v28.26,32.71
CAM_1_LED1
  Top 0.25: U1.9 35.88,85.41 37.79,85.41 40.96,82.23 40.96,80.33 41.81,79.48 R4.2
CAM_1_LED2
  Top 0.25: U1.17 51.12,80.33 46.04,80.33 44.77,79.06 R5.2
CAM_1_RX
  Top 0.25: U6.16 38.42,56.61 38.42,82.87 U1.11
CAM_1_TX  (via drill 0.3)
  Top 0.25: v42.23,51.75 42.23,50.26 U6.17
  Bottom 0.25: U1.10 42.23,76.52 v42.23,51.75
CAM_2_LED1
  Top 0.25: U2.9 85.41,51.12 85.41,49.21 82.24,46.04 80.97,46.04 79.7,44.77 R6.2
CAM_2_LED2
  Top 0.25: U2.17 82.24,34.61 83.51,35.88 84.78,35.88 85.41,36.51 85.41,37.78 82.24,40.96 80.97,40.96 79.7,42.23 R7.2
CAM_2_RX
  Top 0.25: U2.11 80.33,46.04 55.5,46.04 52.56,43.1 49.64,43.1 45.73,39.2 45.73,38.79 U6.53 | U6.53
CAM_2_TX
  Top 0.25: 49.35,35.88 82.87,35.88 U2.10 | U6.54 49.35,35.88 | 49.35,35.88
CAM_3_LED1
  Top 0.25: R8.2 45.19,7.52 48.58,4.13 51.12,4.13 U3.9
CAM_3_LED2
  Top 0.25: U3.17 35.88,4.13 35.88,2.22 36.52,1.59 37.79,1.59 40.96,4.76 40.96,6.67 41.81,7.52 R11.2
CAM_3_RX  (via drill 0.3)
  Top 0.25: v38.42,14.29 39.12,14.99 39.12,38.06 U6.42
  Bottom 0.25: v38.42,14.29 U3.11
CAM_3_TX
  Top 0.25: U3.10 39.52,5.23 39.52,37.75 U6.43
CAM_4_LED1
  Top 0.25: U4.9 1.59,35.88 1.59,37.78 4.77,40.96 6.04,40.96 7.31,42.23 R12.2
CAM_4_LED2
  Top 0.25: U4.17 4.13,51.12 2.23,51.12 1.59,50.48 1.59,49.21 4.77,46.04 6.04,46.04 7.31,44.77 R13.2
CAM_4_RX
  Top 0.25: U4.11 5.4,39.69 37.22,39.69 U6.37
CAM_4_TX
  Top 0.25: 39.15,40.91 39.15,41.32 37.43,43.03 37.14,43.03 36.34,42.23 11.75,42.23 7.94,46.04 6.67,46.04 U4.10 | U6.38 39.15,40.91 | 39.15,40.91
CAM_RX
  Top 0.25: XH1.1 58.64,49.75 52.39,43.5 49.47,43.5 45.33,39.36 45.33,38.49 U6.52
CAM_TX
  Top 0.25: XH1.2 60.65,49.15 60.65,50.48 60.01,51.12 57.47,51.12 56.84,50.48 56.84,48.51 52.22,43.9 49.3,43.9 44.93,39.53 44.93,38.18 U6.51
F446RE_RST  (via drill 0.3)
  Top 0.25: U6.7 49.22,48.15 v49.22,49.21 49.22,49.85 48.8,50.27 C11.1
  Bottom 0.25: XH6.3 60.65,30.18 60.65,40.32 60.01,40.96 57.47,40.96 v49.22,49.21
GND  (via drill 0.3)
  Top 0.25: U6.18 40.54,51.06 C13.2 | U6.12 47.31,49.78 47.31,50.48 48.58,51.75 C11.2 | 51.12,40.48 51.12,40.47 | 51.12,40.47 51.12,39.69 51.76,39.05 52.18,39.05 C4.2 | C14.2 41.6,32.7 40.33,33.97 40.33,35.73 U6.47 | U6.31 36.36,46.04 32.39,46.04 C12.2 | U6.63 50.9,40.69 50.9,40.68 51.12,40.47
  other vias: 39.69,43.5 47.31,43.5 50.49,40.32 46.68,36.51 43.5,36.51 36.52,49.85 38.42,48.58 39.69,49.85 37.79,65.09 33.34,84.77 39.06,85.41 2.23,53.66 1.59,47.94 1.59,39.05 2.23,33.34 33.34,2.22 39.06,1.59 84.78,33.34 85.41,39.05 83.51,38.42 85.41,47.94 84.78,53.66 71.44,55.56 51.12,44.77 56.2,50.48 48.58,48.58 57.47,53.66 58.74,55.56 57.47,70.17 48.58,79.69 48.58,80.96 46.04,81.6 39.06,82.87 5.4,40.32 3.5,40.96 6.04,47.94 3.5,46.04 12.39,42.86 35.25,46.67 34.61,51.12 32.71,50.48 39.06,57.47 52.39,42.23 56.2,45.4 57.47,43.5 54.3,36.51 58.11,35.24 60.01,35.24 59.38,29.53 56.84,26.35 54.93,28.26 46.04,5.4 40.33,5.4 40.96,3.49 40.33,30.8 38.42,30.8 25.09,25.08 24.45,21.27 29.53,21.91 47.31,26.99 32.07,39.05 20.64,40.96 58.11,51.75 42.87,75.88 56.84,36.51 56.84,40.32 69.54,23.81 40.33,15.56 40.33,13.65 26.99,39.05 20.64,43.5 78.43,45.4 79.7,46.67 83.51,46.04 83.51,40.96 72.71,28.26 9.21,43.5 65.09,46.67 58.74,63.18
  pour Top (isolate 0.25): -2.22,90.49 89.22,90.49 89.22,-7.3 -2.22,-7.3
  pour Bottom (isolate 0.25): -2.22,90.49 87.95,90.49 87.95,-7.3 -2.22,-7.3
IR_RX
  Bottom 0.25: XH1.3 60.65,46.65 60.65,62.62 58.34,64.92 58.34,71.04 59.38,72.07 61.28,72.07 P2.2
IR_TX
  Bottom 0.25: XH1.4 58.76,42.25 61.05,44.54 61.05,62.78 58.74,65.09 58.74,69.53 P2.1
LED1
  Top 0.25: U6.29 33.97,49.85 31.44,49.85 R2.2
LED2
  Top 0.25: U6.28 33.31,51.22 R3.2
LED3
  Top 0.25: U6.27 35.25,49.99 35.25,53.66 R9.2
LED4
  Top 0.25: U6.26 37.15,48.79 37.15,55.56 R10.2
N$1
  Top 0.25: U6.30 35.17,47.94 C1.1
N$2
  Top 0.25: R1.2 50.49,37.57 50.49,38.99 U6.60
N$3
  Top 0.25: C2.1 53.66,52.81 52.39,51.54 X2.P$2 52.39,49.91 U6.5
N$4
  Top 0.25: U6.6 51.12,49.35 51.12,54.93 52.25,56.06 X2.P$1 52.39,56.2 54.3,58.1 55.99,58.1 C3.1
N$5
  Top 0.25: L2.A R3.1
N$6
  Top 0.25: L4.A R10.1
N$7
  Top 0.25: L1.A R2.1
N$8
  Top 0.25: L6.A R5.1
N$9
  Top 0.25: L3.A R9.1
N$10
  Top 0.25: L5.A R4.1
N$11
  Top 0.25: R7.1 L8.A
N$12
  Top 0.25: R6.1 L7.A
N$13
  Top 0.25: L10.A R11.1
N$14
  Top 0.25: R8.1 L9.A
N$15
  Top 0.25: L12.A R13.1
N$16
  Top 0.25: R12.1 L11.A
PA_13
  Top 0.25: XH6.2 58.8,25.72 46.68,25.72 39.92,32.47 39.92,36.03 U6.46
PA_14
  Top 0.25: 54.07,27.62 XH6.1 | U6.49 54.07,27.62 | 54.07,27.62
RXD0
  Bottom 0.25: P2.4 63.82,66.99 63.82,29.53 65.71,27.64 XH6.4
TXD0
  Bottom 0.25: XH6.5 68.21,27.68 64.22,31.67 64.22,68.5 63.19,69.53 61.28,69.53 P2.3
UI_RX_HV
  Top 0.25: Q2.3 32.92,37.78 29.75,37.78 R15.1 29.32,37.78 26.36,37.78 16.3,27.72 XH4.1
UI_RX_LV  (via drill 0.3)
  Top 0.25: Q2.2 34.5,35.88 36.73,35.88 R14.1 37.57,35.88 v38.42,35.88
  Bottom 0.25: v38.42,35.88 54.87,35.88 XH1.5
UI_TX_HV
  Top 0.25: R17.1 29.64,33.45 | 29.64,33.45 29.75,33.34 32.92,33.34 Q3.3 | XH4.2 18.8,27.68 24.45,33.34 29.53,33.34 29.64,33.45
UI_TX_LV  (via drill 0.3)
  Top 0.25: Q3.2 34.5,31.43 36.73,31.43 R16.1 37.37,32.07 v38.42,32.07
  Bottom 0.25: XH1.6 58.74,37.15 53.66,32.07 v38.42,32.07

### Text on the board
tPlace: 5V | 5V